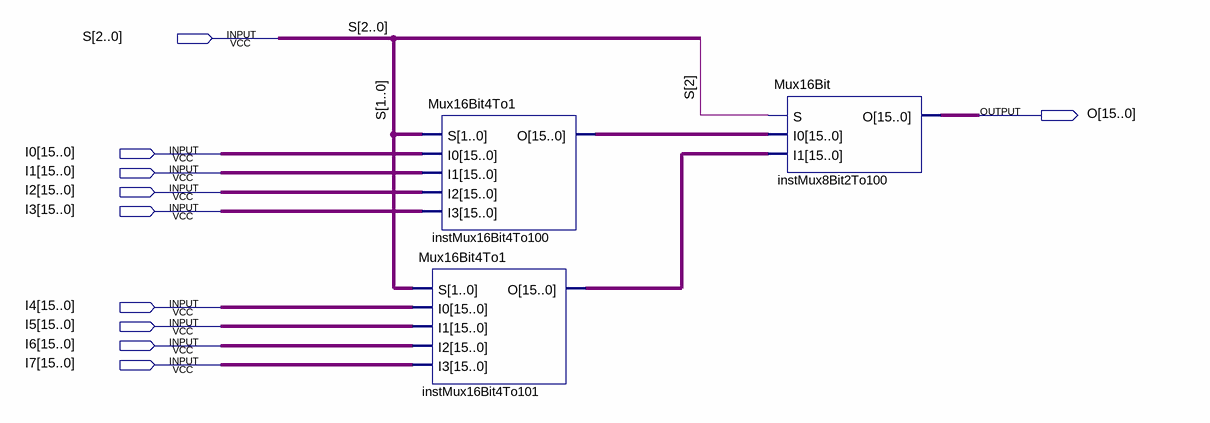
[diagram p0: schematic sheet]
// Quartus schematic Mux16Bit8To1.bdf as structural Verilog: 3 symbols, 10 pins
module Mux16Bit8To1 (
  input  [2:0] S,
  input  [15:0] I0,
  input  [15:0] I1,
  input  [15:0] I2,
  input  [15:0] I3,
  input  [15:0] I4,
  input  [15:0] I5,
  input  [15:0] I6,
  input  [15:0] I7,
  output [15:0] O
);

  wire [15:0] instMux16Bit4To100_o, instMux16Bit4To101_o;

  Mux16Bit4To1 instMux16Bit4To100 (.S(S[1:0]), .I0(I0), .I1(I1), .I2(I2), .I3(I3), .O(instMux16Bit4To100_o));
  Mux16Bit4To1 instMux16Bit4To101 (.S(S[1:0]), .I0(I4), .I1(I5), .I2(I6), .I3(I7), .O(instMux16Bit4To101_o));
  Mux16Bit instMux8Bit2To100 (.S(S[2]), .I0(instMux16Bit4To100_o), .I1(instMux16Bit4To101_o), .O(O));
endmodule
